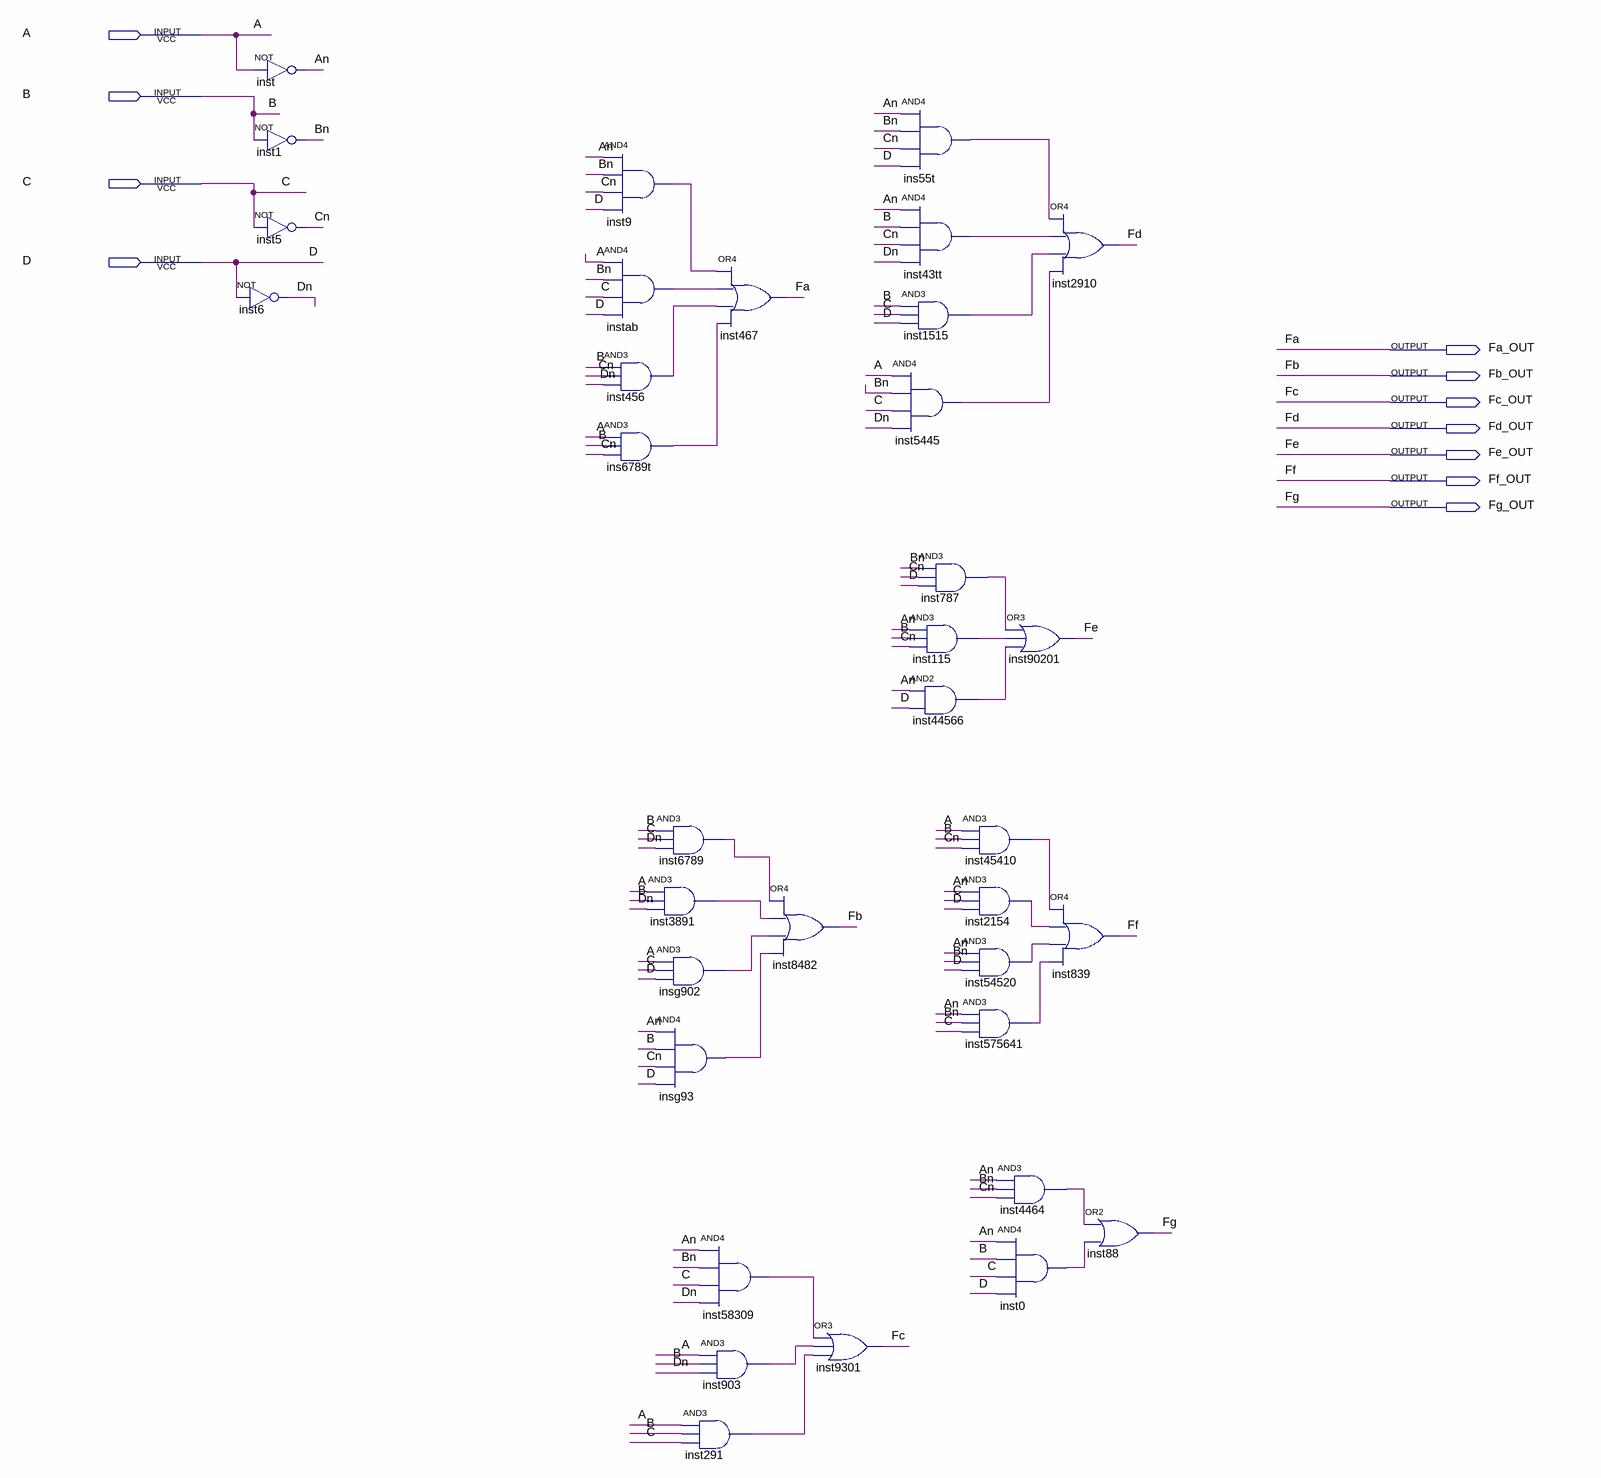
[diagram p0: schematic sheet]
// Quartus schematic Lab2.bdf as structural Verilog: 35 symbols, 11 pins
module Lab2 (
  input  A,
  input  B,
  input  C,
  input  D,
  output Fa_OUT,
  output Fb_OUT,
  output Fc_OUT,
  output Fd_OUT,
  output Fe_OUT,
  output Ff_OUT,
  output Fg_OUT
);

  wire An, Bn, Cn, Dn, ins55t_out, ins6789t_out, insg93_out, insg902_out, inst0_out, inst9_out, inst43tt_out,
       inst115_out, inst291_out, inst456_out, inst787_out, inst903_out, inst1515_out, inst2154_out,
       inst3891_out, inst4464_out, inst5445_out, inst6789_out, inst44566_out, inst45410_out, inst54520_out,
       inst58309_out, inst575641_out, instab_out;

  not inst (An, A);
  not inst1 (Bn, B);
  not inst5 (Cn, C);
  not inst6 (Dn, D);
  and inst9 (inst9_out, An, Bn, Cn, D);
  and instab (instab_out, A, Bn, C, D);
  and inst456 (inst456_out, B, Cn, Dn);
  and ins6789t (ins6789t_out, A, B, Cn);
  and inst6789 (inst6789_out, B, C, Dn);
  and inst3891 (inst3891_out, A, B, Dn);
  and insg902 (insg902_out, A, C, D);
  and insg93 (insg93_out, An, B, Cn, D);
  and inst58309 (inst58309_out, An, Bn, C, Dn);
  and inst903 (inst903_out, A, B, Dn);
  and inst291 (inst291_out, A, B, C);
  or inst467 (Fa_OUT, inst9_out, instab_out, inst456_out, ins6789t_out);
  or inst8482 (Fb_OUT, inst6789_out, inst3891_out, insg902_out, insg93_out);
  or inst9301 (Fc_OUT, inst58309_out, inst903_out, inst291_out);
  and ins55t (ins55t_out, An, Bn, Cn, D);
  and inst43tt (inst43tt_out, An, B, Cn, Dn);
  and inst1515 (inst1515_out, B, C, D);
  and inst5445 (inst5445_out, A, Bn, C, Dn);
  and inst787 (inst787_out, Bn, Cn, D);
  and inst115 (inst115_out, An, B, Cn);
  and inst44566 (inst44566_out, An, D);
  and inst45410 (inst45410_out, A, B, Cn);
  and inst2154 (inst2154_out, An, C, D);
  and inst54520 (inst54520_out, An, Bn, D);
  and inst575641 (inst575641_out, An, Bn, C);
  or inst2910 (Fd_OUT, ins55t_out, inst43tt_out, inst1515_out, inst5445_out);
  or inst90201 (Fe_OUT, inst787_out, inst115_out, inst44566_out);
  or inst839 (Ff_OUT, inst45410_out, inst2154_out, inst54520_out, inst575641_out);
  and inst4464 (inst4464_out, An, Bn, Cn);
  and inst0 (inst0_out, An, B, C, D);
  or inst88 (Fg_OUT, inst4464_out, inst0_out);

  // Other names for the same wires on the sheet: Fa = Fa_OUT; Fb = Fb_OUT; Fc = Fc_OUT; Fd = Fd_OUT; Fe = Fe_OUT;
  //   Ff = Ff_OUT; Fg = Fg_OUT
endmodule
